# Altium schematic sheet interface.SchDoc
size A4
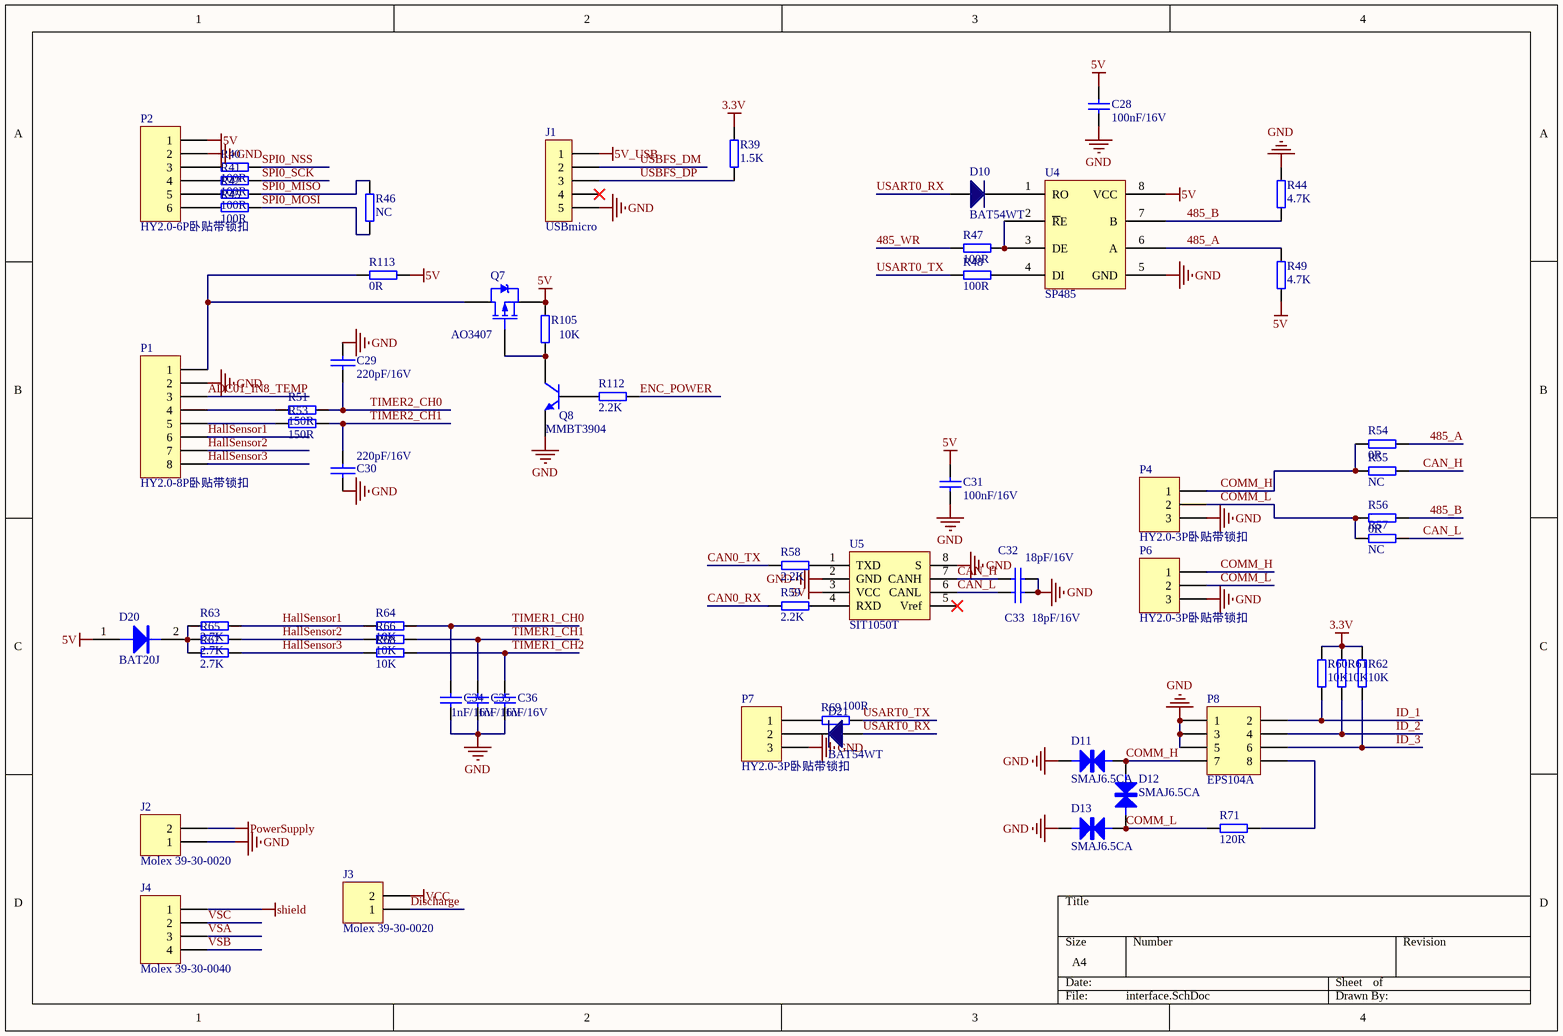
[diagram p0: interface.SchDoc]

## Parts
C28  100nF/16V  [C0402]
C29  220pF/16V  [C0402]
C30  220pF/16V  [C0402]
C31  100nF/16V  [C0402]
C32  18pF/16V  [C0402]
C33  18pF/16V  [C0402]
C34  1nF/16V  [C0402]
C35  1nF/16V  [C0402]
C36  1nF/16V  [C0402]
D10  BAT54WT  [SOD-523/SC-79]
D11  SMAJ6.5CA  [DO-214AC SMA]
D12  SMAJ6.5CA  [DO-214AC SMA]
D13  SMAJ6.5CA  [DO-214AC SMA]
D20  BAT20J  [SOD-323]
D21  BAT54WT  [SOD-523/SC-79]
J1  USBmicro  [USBmicro]
J2  Molex 39-30-0020  [Molex 39-30-0020]
J3  Molex 39-30-0020  [Molex 39-30-0020]
J4  Molex 39-30-0040  [Molex 39-30-0040]
P1  HY2.0-8P卧贴带锁扣  [2.0-8PIN 卧式]
P2  HY2.0-6P卧贴带锁扣  [2.0-6PIN 卧式]
P4  HY2.0-3P卧贴带锁扣  [2.0-3PIN 卧式]
P6  HY2.0-3P卧贴带锁扣  [2.0-3PIN 卧式]
P7  HY2.0-3P卧贴带锁扣  [2.0-3PIN 卧式]
P8  EPS104A  [EPG104A]
Q7  AO3407  [SOT-23]
Q8  MMBT3904  [SOT-23]
R39  1.5K  [R0402]
R40  100R  [R0402]
R41  100R  [R0402]
R42  100R  [R0402]
R44  4.7K  [R0402]
R45  100R  [R0402]
R46  NC  [R0603]
R47  100R  [R0402]
R48  100R  [R0402]
R49  4.7K  [R0402]
R51  150R  [R0402]
R53  150R  [R0402]
R54  0R  [R0603]
R55  NC  [R0603]
R56  0R  [R0603]
R57  NC  [R0603]
R58  2.2K  [R0402]
R59  2.2K  [R0402]
R60  10K  [R0402]
R61  10K  [R0402]
R62  10K  [R0402]
R63  2.7K  [R0402]
R64  10K  [R0402]
R65  2.7K  [R0402]
R66  10K  [R0402]
R67  2.7K  [R0402]
R68  10K  [R0402]
R69  100R  [R0402]
R71  120R  [R0603]
R105  10K  [R0402]
R112  2.2K  [R0402]
R113  0R  [R0805]
U4  SP485  [SOIC-8]
U5  SIT1050T  [SOIC-8]

## Nets
3.3V: R39.2 R60.2 R61.2 R62.2
5V: C28.1 C31.1 D20.1(A) P2.1 Q7.2(S) R49.1 R105.2 R113.2 U4.8(VCC) U5.3(VCC)
5V_USB: J1.1
GND: C28.2 C29.2 C30.1 C31.2 C32.1 C33.1 C34.2 C35.2 C36.2 D11.1(Anode) D13.1(Anode) J1.5 J2.1 P1.2 P2.2 P4.3 P6.3 P7.3 P8.1 P8.3 P8.5 Q8.2(E) R44.2 U4.5(GND) U5.2(GND) U5.8(S)
PowerSupply: J2.2
shield: J4.1
VCC: J3.2
485_A: R49.2 R54.1 U4.6(A)
485_B: R44.1 R56.1 U4.7(B)
485_WR: R47.2
ADC01_IN8_TEMP: P1.3
CAN0_RX: R59.2
CAN0_TX: R58.2
CAN_H: C32.2 R55.1 U5.7(CANH)
CAN_L: C33.2 R57.1 U5.6(CANL)
COMM_H: D11.2(Anode) D12.1(Anode) P4.1 P6.1 P8.7 R54.2 R55.2
COMM_L: D12.2(Anode) D13.2(Anode) P4.2 P6.2 R56.2 R57.2 R71.2
Discharge: J3.1
ENC_POWER: R112.2
HallSensor1: P1.6 R63.1 R64.1
HallSensor2: P1.7 R65.1 R66.1
HallSensor3: P1.8 R67.1 R68.1
ID_1: P8.2 R60.1
ID_2: P8.4 R61.1
ID_3: P8.6 R62.1
SPI0_MISO: R42.1 R46.1
SPI0_MOSI: R45.1 R46.2
SPI0_NSS: R40.1
SPI0_SCK: R41.1
TIMER1_CH0: C34.1 R64.2
TIMER1_CH1: C35.1 R66.2
TIMER1_CH2: C36.1 R68.2
TIMER2_CH0: C29.1 R51.2
TIMER2_CH1: C30.2 R53.2
USART0_RX: D10.1 D21.1
USART0_TX: R48.2 R69.1
USBFS_DM: J1.2
USBFS_DP: J1.3 R39.1
VSA: J4.3
VSB: J4.4
VSC: J4.2
NetD10_2: D10.2 U4.1(RO)
NetD20_2: D20.2(K) R63.2 R65.2 R67.2
NetD21_2: D21.2 P7.2
NetP1_1: P1.1 Q7.3(D) R113.1
NetP1_4: P1.4 R51.1
NetP1_5: P1.5 R53.1
NetP2_3: P2.3 R40.2
NetP2_4: P2.4 R41.2
NetP2_5: P2.5 R42.2
NetP2_6: P2.6 R45.2
NetP7_1: P7.1 R69.2
NetP8_8: P8.8 R71.1
NetQ7_1: Q7.1(G) Q8.3(C) R105.1
NetQ8_1: Q8.1(B) R112.1
NetR47_1: R47.1 U4.2(~{R}E) U4.3(DE)
NetR48_1: R48.1 U4.4(DI)
NetR58_1: R58.1 U5.1(TXD)
NetR59_1: R59.1 U5.4(RXD)

Not connected (* = marked no-connect by the designer): J1 4*; U5 5(Vref)*

## Library data of the parts
C28 C31-C36 = cap
C29 C30 = CAP: Capacitor
D10 D21 = Diode
D11-D13 = Bi-DIODES
D20 = DIODE
J1 = CON5: USB micro母座
J2 J3 = Header 2: Header, 2-Pin; LatestRevisionDate: 17-Jul-2002; LatestRevisionNote: Re-released for DXP Platform.; Publisher: Altium Limited
J4 = Header 4: Header, 4-Pin; LatestRevisionDate: 17-Jul-2002; LatestRevisionNote: Re-released for DXP Platform.; Publisher: Altium Limited
P1 = Header 8: LatestRevisionDate: 17-Jul-2002; LatestRevisionNote: Re-released for DXP Platform.; Publisher: Altium Limited
P2 = Header 6: LatestRevisionDate: 17-Jul-2002; LatestRevisionNote: Re-released for DXP Platform.; Publisher: Altium Limited
P4 P6 P7 = Header 3: LatestRevisionDate: 17-Jul-2002; LatestRevisionNote: Re-released for DXP Platform.; Publisher: Altium Limited
P8 = Header 4X2: 侧拨程式开关 2.54间距 4PIN 品牌：台湾ECE; LatestRevisionDate: 17-Jul-2002; LatestRevisionNote: Re-released for DXP Platform.; Publisher: Altium Limited
Q7 = P-channel Enhancement MOS
Q8 = NPN
R39-R42 R44-R49 R51 R53-R69 R71 R105 R112 R113 = Resistance
U5 = TJA1050